# EAGLE schematic DisplayAddOn_V02-010 (EAGLE 9.2.2)
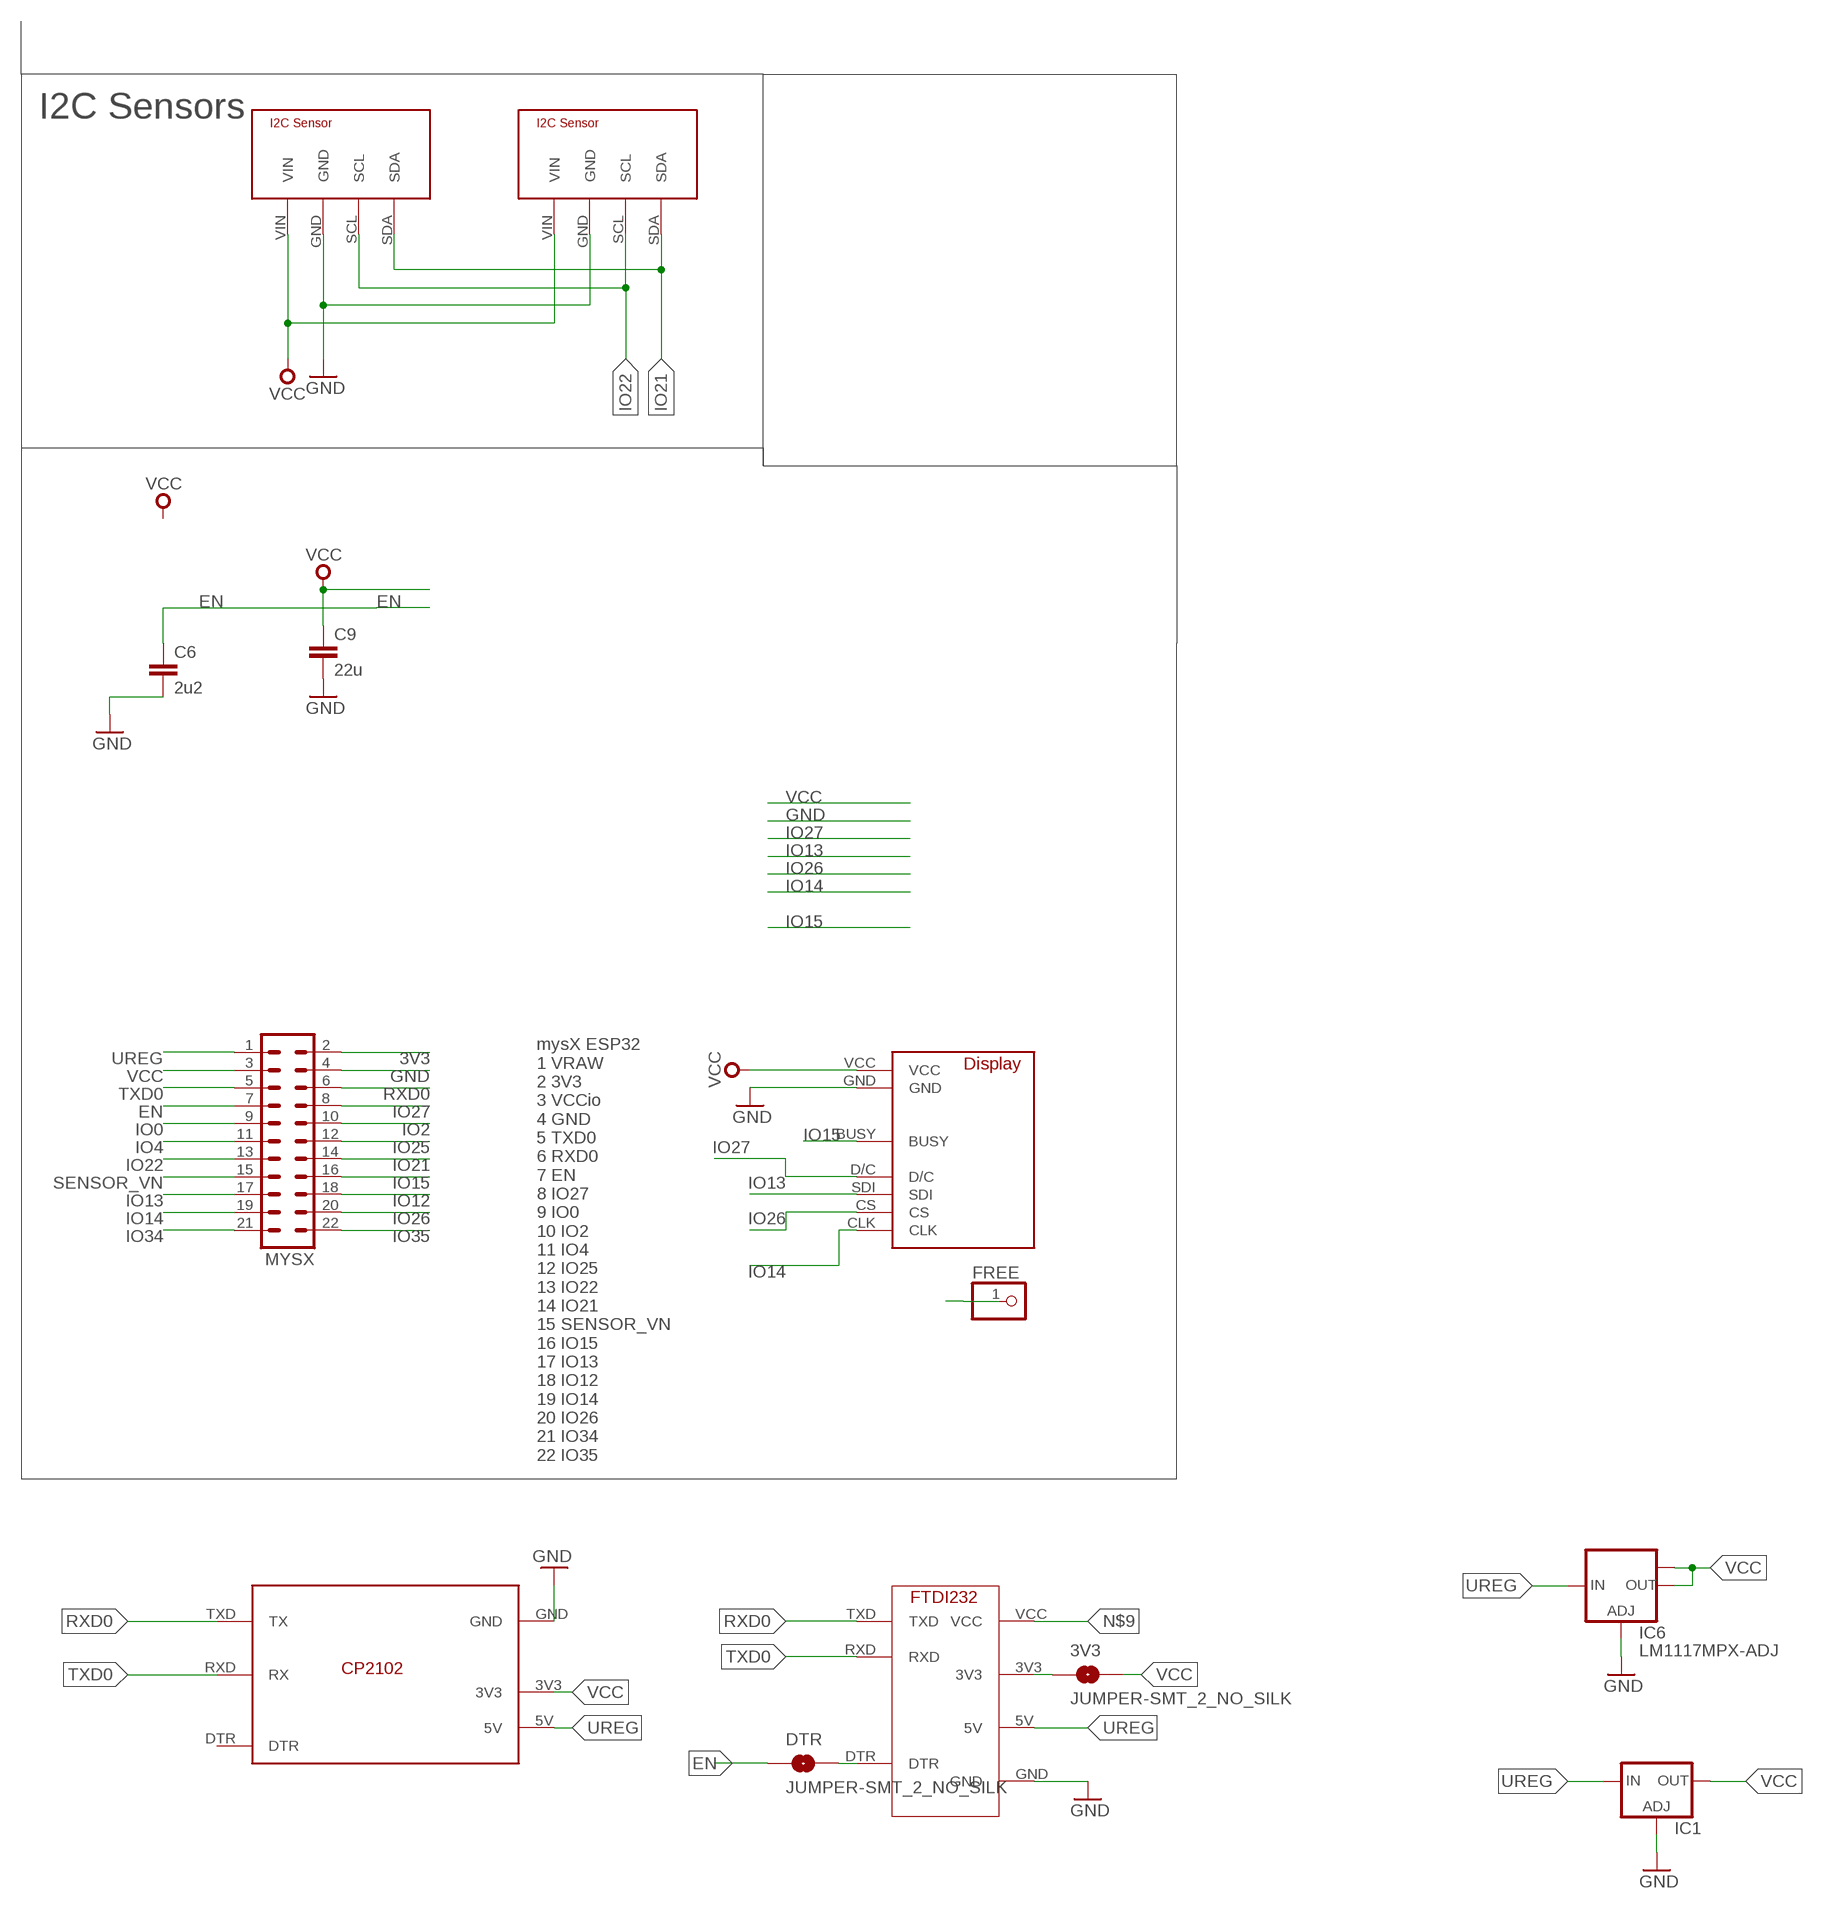
[diagram p0: schematic, sheet 1]

## Parts
3V3  JUMPER-SMT_2_NO_SILK  [SMT-JUMPER_2_NO_SILK]
C6  2u2  C-EUC0805  [C0805]
C9  22u  C-EUC0805  [C0805]
DTR  JUMPER-SMT_2_NO_SILK  [SMT-JUMPER_2_NO_SILK]
FREE  PINHD-1X1  [1X01]
HELTEK  ZUCZUG_1.54  [ZUCZUG_1.54INCH]
IC1  LD117ADT50TR  [DPACK]
IC6  LM1117MPX-ADJ  [SOT223]
MYSX  MA11-2  [MA11-2]
U$1  CP2101  [CP2101-BEAKOUT]
U$2  I2C-BREAKOUT  [I2C_BREAKOUT]
U$3  FTDI232  [FTDI232-LARGE-LESS-PINS]
U$4  I2C-BREAKOUT  [I2C_BREAKOUT]

## Nets
3V3: MYSX.2
EN: C6.1 DTR.1 MYSX.7
FREE: FREE.1
GND [gnd]: C6.2 C9.2 HELTEK.GND IC1.1(ADJ) IC6.1(ADJ) MYSX.4 U$1.GND U$2.GND U$3.GND U$4.GND
IO0: MYSX.9
IO2: MYSX.10
IO4: MYSX.11
IO12: MYSX.18
IO13: HELTEK.SDI MYSX.17
IO14: HELTEK.CLK MYSX.19
IO15: HELTEK.BUSY MYSX.16
IO21: MYSX.14 U$2.SDA U$4.SDA
IO22: MYSX.13 U$2.SCL U$4.SCL
IO25: MYSX.12
IO26: HELTEK.CS MYSX.20
IO27: HELTEK.D/C MYSX.8
IO34: MYSX.21
IO35: MYSX.22
N$1: DTR.2 U$3.DTR
N$2: 3V3.1 U$3.3V3
N$9: U$3.VCC
RXD0: MYSX.6 U$1.TXD(TX) U$3.TXD
SENSOR_VN: MYSX.15
TXD0: MYSX.5 U$1.RXD(RX) U$3.RXD
UREG [gnd]: IC1.3(IN) IC6.3(IN) MYSX.1 U$1.5V U$3.5V
VCC [gnd]: 3V3.2 C9.1 HELTEK.VCC IC1.4(OUT) IC6.2(OUT) IC6.TAB(OUT1) MYSX.3 U$1.3V3 U$2.VIN U$4.VIN
Unconnected: U$1.DTR

## Notes on the sheet
- I2C Sensors
- mysX ESP32
  1 VRAW
  2 3V3
  3 VCCio
  4 GND
  5 TXD0
  6 RXD0
  7 EN
  8 IO27
  9 IO0
  10 IO2
  11 IO4
  12 IO25
  13 IO22
  14 IO21
  15 SENSOR_VN
  16 IO15
  17 IO13
  18 IO12
  19 IO14
  20 IO26
  21 IO34
  22 IO35

## Library data of the parts
3V3 DTR = SparkFun-Jumpers:JUMPER-SMT_2_NO: Normally open jumper This jumper has two pads in close proximity to each other. Apply solder to close the connection. Round pads are easier to solder for beginners, but are a lot larger. SparkFun Product that uses the round pads: SparkFun EL Sequencer <https://www.sparkfun.com/products/12781>
C6 C9 = rcl@1:C-EU: CAPACITOR, European symbol; SPICEPREFIX: C
FREE = pinhead:PINHD-1X1: PIN HEADER
HELTEK = display_v2:ZUCZUG_1.54
IC1 = v-reg:LD117A?*: Low drop fixed and adjustable positive voltage regulators 1 A Source: http://www.st.com/stonline/products/literature/ds/7194/ld1117axx.pdf
IC6 = lm1117:LM1117MPX-ADJ
MYSX = con-Pinheader:MA11-2: PIN HEADER; OC_FARNELL: unknown; OC_NEWARK: unknown
U$1 = Martin-USB-V002:CP2101
U$2 U$4 = i2c:I2C-BREAKOUT
U$3 = Martin-USB-V002:FTDI232

## Net classes
0 default: width 0.356 mm, clearance 0.254 mm
1 gnd: width 0.61 mm, clearance 0.254 mm
2 vcc: width 0.61 mm, clearance 0.254 mm